# Altium schematic sheet ArduinoDevelopBoard.SchDoc
size 420 x 297 mm; Address1: Address1; Address2: Address2; Address3: Address3; Address4: Address4; DocumentNumber: АБВГ.123456.001 Э3; SheetNumber: 1; Scale: 1:1; DocumentType: Схема электрическая принципиальная; FirstReferrence: АБВГ.123456.001
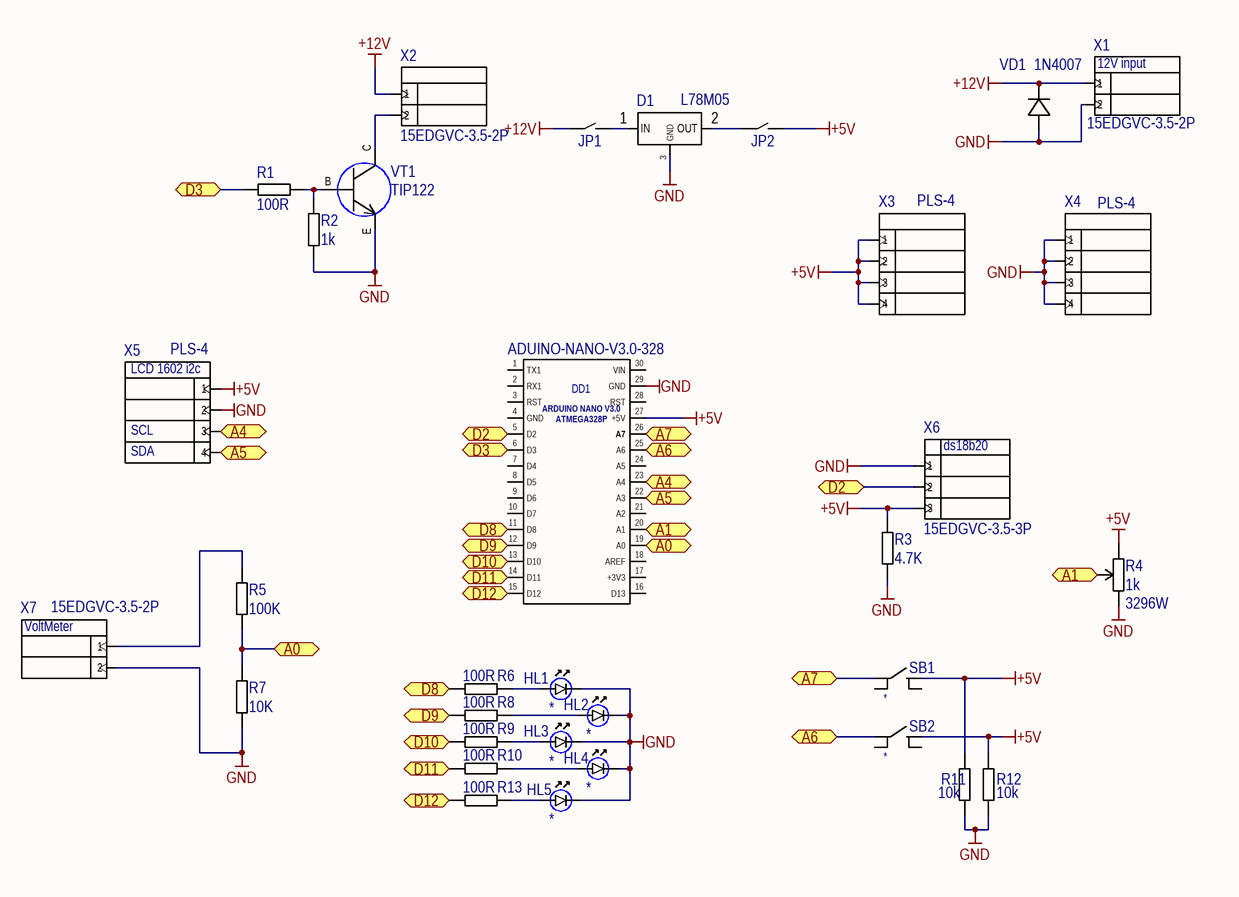
[diagram p0: ArduinoDevelopBoard.SchDoc]

## Parts
D1  L78M05  [D-PAK]
DD1  ADUINO-NANO-V3.0-328  [ARDUINO_NANO_V3.0]
HL1  *  [Led Diode 5mm]
HL2  *  [Led Diode 5mm]
HL3  *  [Led Diode 5mm]
HL4  *  [Led Diode 5mm]
HL5  *  [Led Diode 5mm]
JP1  Jumper  [PLS-2]  (value not drawn)
JP2  Jumper  [PLS-2]  (value not drawn)
R1  100R  [Resistor-0.25W]
R2  1k  [Resistor-0.25W]
R3  4.7K  [Resistor-0.25W]
R4  1k  [3296W_Resistor]
R5  100K  [Resistor-0.25W]
R6  100R  [Resistor-0.25W]
R7  10K  [Resistor-0.25W]
R8  100R  [Resistor-0.25W]
R9  100R  [Resistor-0.25W]
R10  100R  [Resistor-0.25W]
R11  10k  [Resistor-0.25W]
R12  10k  [Resistor-0.25W]
R13  100R  [Resistor-0.25W]
SB1  *  [KLS7-TS6601-5.0-180]
SB2  *  [KLS7-TS6601-5.0-180]
VD1  1N4007  [Diode (DO41)]
VT1  TIP122  [TO220]
X1  15EDGVC-3.5-2P  [15EDGVC-3.5-2P]
X2  15EDGVC-3.5-2P  [15EDGVC-3.5-2P]
X3  PLS-4  [PLS-4]
X4  PLS-4  [PLS-4]
X5  PLS-4  [PLS-4]
X6  15EDGVC-3.5-3P  [15EDGVC-3.5-3P]
X7  15EDGVC-3.5-2P  [15EDGVC-3.5-2P]

## Ports
A0, A1, A4, A5, A6, A7, D2, D3, D8, D9, D10, D11, D12

## Nets
+5V: DD1.27(+5V) JP2.2 R3.2 R4.3 R11.2 R12.2 SB1.3 SB2.3 X3.1 X3.2 X3.3 X3.4 X5.1 X6.3
+12V: JP1.1 VD1.2 X1.1 X2.1
GND: D1.3(GND) DD1.29(GND) HL1.2 HL2.2 HL3.2 HL4.2 HL5.2 R2.2 R3.1 R4.1 R7.1 R11.1 R12.1 VD1.1 VT1.E X1.2 X4.1 X4.2 X4.3 X4.4 X5.2 X6.1 X7.2
A0: DD1.19(A0) R5.1 R7.2 ; port A0
A1: DD1.20(A1) R4.2 ; port A1
A4: DD1.23(A4) X5.3 ; port A4
A5: DD1.22(A3) X5.4 ; port A5
A6: DD1.25(A6) SB2.1 ; port A6
A7: DD1.26(A7) SB1.1 ; port A7
D2: DD1.5(D2) X6.2 ; port D2
D3: DD1.6(D3) R1.2 ; port D3
D8: DD1.11(D8) R6.1 ; port D8
D9: DD1.12(D9) R8.1 ; port D9
D10: DD1.13(D10) R9.1 ; port D10
D11: DD1.14(D11) R10.1 ; port D11
D12: DD1.15(D12) R13.1 ; port D12
NetD1_1: D1.1(IN) JP1.2
NetD1_2: D1.2(OUT) JP2.1
NetHL1_1: HL1.1 R6.2
NetHL2_1: HL2.1 R8.2
NetHL3_1: HL3.1 R9.2
NetHL4_1: HL4.1 R10.2
NetHL5_1: HL5.1 R13.2
NetR1_1: R1.1 R2.1 VT1.B
NetR5_2: R5.2 X7.1
NetVT1_C: VT1.C X2.2

Not connected (* = marked no-connect by the designer): DD1 1(TX1) 2(RX1) 3(RST) 4(GND) 7(D4) 8(D5) 9(D6) 10(D7) 16(D13) 17(+3V3) 18(AREF) 21(A2) 24(A5) 28(RST) 30(VIN); SB1 2 4; SB2 2 4

## Notes on the sheet
- (near X1) 12V input
- (near X5) LCD 1602 i2c
- SDA
- SCL
- (near X6) ds18b20
- (near X7) VoltMeter
- Перв. примен.
- Справ. №
- Подп. и дата
- Инв. № дубл.
- Взам. инв. №
- Разраб.
- Изм.
- Лист
- № докум.
- Подп.
- Дата
- Лит.
- Масса
- Масштаб
- Пров.
- Т.контр.
- Листов
- Инв. № подл.
- Утв.
- Н.контр.
- 2.106-A3
- Копировал
- Формат А3
- (in symbol ARDUINO-NANO-V3.0-328) ARDUINO NANO V3.0; ATMEGA328P

## Library data of the parts
DD1 = ARDUINO-NANO-V3.0-328
HL1-HL5 = Led-5mm: Color: *
R1-R3 R5 R7 R11 R12 = Resistor 0.25W: =Power; Power: *
  R1: Value: 100R
  R2: Value: 1k
  R3: Value: 4.7K
  R5: Value: 100K
  R7: Value: 10K
  R11 R12: Value: 10k
R4 = 3296W: 3296; Value: 1k; Case: 3296W
R6 R8-R10 R13 = Resistor 0.25W: =Power; Value: 240R; Power: *
SB1 SB2 = KLS7-TS6601-5.0-180: Model: *
VD1 = 1N4007: 1A, 1000V
VT1 = TIP122: PNP Transistor; pin to pad: B>1 C>2 E>3
X1 X2 X7 = Connector-2Pin: Case: 15EDGVC-3.5-2P
X3-X5 = Connector-4Pin: Case: PLS-4
X6 = Connector-3Pin: Case: 15EDGVC-3.5-3P